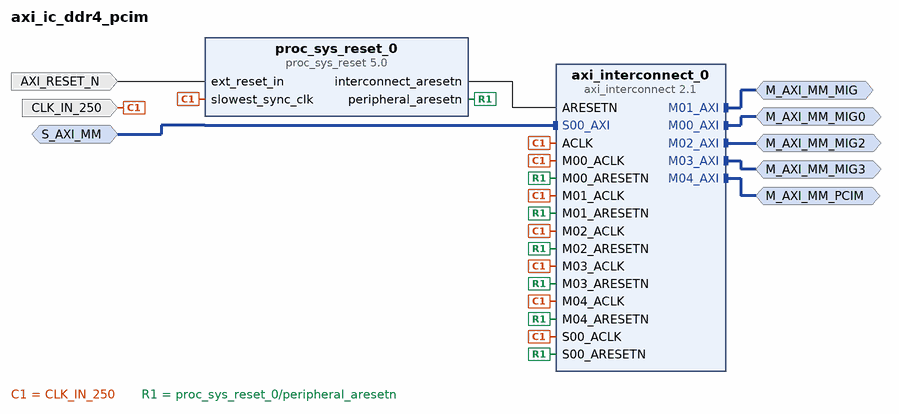
[diagram p0: block diagram of the top level]
# Vivado block design axi_ic_ddr4_pcim, xcu200-fsgd2104-2-e, Vivado 2019.2
create_bd_design axi_ic_ddr4_pcim

create_bd_intf_port -mode Slave -vlnv xilinx.com:interface:aximm_rtl:1.0 S_AXI_MM
set_property -dict [list \
  CONFIG.DATA_WIDTH 512 \
  CONFIG.PROTOCOL AXI4 \
  CONFIG.FREQ_HZ 250000000 \
  CONFIG.ID_WIDTH 6 \
  CONFIG.ADDR_WIDTH 64 \
  CONFIG.AWUSER_WIDTH 0 \
  CONFIG.ARUSER_WIDTH 0 \
  CONFIG.WUSER_WIDTH 0 \
  CONFIG.RUSER_WIDTH 0 \
  CONFIG.BUSER_WIDTH 0 \
  CONFIG.READ_WRITE_MODE READ_WRITE \
  CONFIG.HAS_BURST 1 \
  CONFIG.HAS_LOCK 1 \
  CONFIG.HAS_PROT 1 \
  CONFIG.HAS_CACHE 1 \
  CONFIG.HAS_QOS 1 \
  CONFIG.HAS_REGION 1 \
  CONFIG.HAS_WSTRB 1 \
  CONFIG.HAS_BRESP 1 \
  CONFIG.HAS_RRESP 1 \
  CONFIG.SUPPORTS_NARROW_BURST 0 \
  CONFIG.NUM_READ_OUTSTANDING 8 \
  CONFIG.NUM_WRITE_OUTSTANDING 8 \
  CONFIG.MAX_BURST_LENGTH 64 \
  CONFIG.CLK_DOMAIN PCIe_Bridge_ICAP_complex_xdma_0_0_axi_aclk \
  CONFIG.NUM_READ_THREADS 1 \
  CONFIG.NUM_WRITE_THREADS 1 \
  CONFIG.RUSER_BITS_PER_BYTE 0 \
  CONFIG.WUSER_BITS_PER_BYTE 0 \
] [get_bd_intf_ports S_AXI_MM]
create_bd_intf_port -mode Master -vlnv xilinx.com:interface:aximm_rtl:1.0 M_AXI_MM_MIG0
set_property -dict [list \
  CONFIG.DATA_WIDTH 512 \
  CONFIG.PROTOCOL AXI4 \
  CONFIG.FREQ_HZ 250000000 \
  CONFIG.ADDR_WIDTH 64 \
  CONFIG.NUM_READ_OUTSTANDING 8 \
  CONFIG.NUM_WRITE_OUTSTANDING 8 \
  CONFIG.CLK_DOMAIN PCIe_Bridge_ICAP_complex_xdma_0_0_axi_aclk \
] [get_bd_intf_ports M_AXI_MM_MIG0]
create_bd_intf_port -mode Master -vlnv xilinx.com:interface:aximm_rtl:1.0 M_AXI_MM_MIG
set_property -dict [list \
  CONFIG.DATA_WIDTH 512 \
  CONFIG.PROTOCOL AXI4 \
  CONFIG.FREQ_HZ 250000000 \
  CONFIG.ADDR_WIDTH 64 \
  CONFIG.NUM_READ_OUTSTANDING 8 \
  CONFIG.NUM_WRITE_OUTSTANDING 8 \
  CONFIG.CLK_DOMAIN PCIe_Bridge_ICAP_complex_xdma_0_0_axi_aclk \
] [get_bd_intf_ports M_AXI_MM_MIG]
create_bd_intf_port -mode Master -vlnv xilinx.com:interface:aximm_rtl:1.0 M_AXI_MM_MIG2
set_property -dict [list \
  CONFIG.DATA_WIDTH 512 \
  CONFIG.PROTOCOL AXI4 \
  CONFIG.FREQ_HZ 250000000 \
  CONFIG.ADDR_WIDTH 64 \
  CONFIG.NUM_READ_OUTSTANDING 8 \
  CONFIG.NUM_WRITE_OUTSTANDING 8 \
  CONFIG.CLK_DOMAIN PCIe_Bridge_ICAP_complex_xdma_0_0_axi_aclk \
] [get_bd_intf_ports M_AXI_MM_MIG2]
create_bd_intf_port -mode Master -vlnv xilinx.com:interface:aximm_rtl:1.0 M_AXI_MM_MIG3
set_property -dict [list \
  CONFIG.DATA_WIDTH 512 \
  CONFIG.PROTOCOL AXI4 \
  CONFIG.FREQ_HZ 250000000 \
  CONFIG.ADDR_WIDTH 64 \
  CONFIG.NUM_READ_OUTSTANDING 8 \
  CONFIG.NUM_WRITE_OUTSTANDING 8 \
  CONFIG.CLK_DOMAIN PCIe_Bridge_ICAP_complex_xdma_0_0_axi_aclk \
] [get_bd_intf_ports M_AXI_MM_MIG3]
create_bd_intf_port -mode Master -vlnv xilinx.com:interface:aximm_rtl:1.0 M_AXI_MM_PCIM
set_property -dict [list \
  CONFIG.DATA_WIDTH 512 \
  CONFIG.PROTOCOL AXI4 \
  CONFIG.FREQ_HZ 250000000 \
  CONFIG.ADDR_WIDTH 64 \
  CONFIG.NUM_READ_OUTSTANDING 8 \
  CONFIG.NUM_WRITE_OUTSTANDING 8 \
  CONFIG.CLK_DOMAIN PCIe_Bridge_ICAP_complex_xdma_0_0_axi_aclk \
] [get_bd_intf_ports M_AXI_MM_PCIM]
create_bd_port -dir I -type rst AXI_RESET_N
create_bd_port -dir I -type clk CLK_IN_250
set_property -dict [list \
  CONFIG.ASSOCIATED_BUSIF S_AXI_MM:M_AXI_MM_MIG3:M_AXI_MM_MIG2:M_AXI_MM_MIG:M_AXI_MM_MIG0:M_AXI_MM_PCIM \
  CONFIG.ASSOCIATED_RESET AXI_RESET_N \
  CONFIG.CLK_DOMAIN PCIe_Bridge_ICAP_complex_xdma_0_0_axi_aclk \
  CONFIG.FREQ_HZ 250000000 \
] [get_bd_ports CLK_IN_250]

create_bd_cell -type ip -vlnv xilinx.com:ip:proc_sys_reset:5.0 proc_sys_reset_0
create_bd_cell -type ip -vlnv xilinx.com:ip:axi_interconnect:2.1 axi_interconnect_0
set_property -dict [list \
  CONFIG.M00_HAS_REGSLICE 4 \
  CONFIG.M01_HAS_REGSLICE 4 \
  CONFIG.M02_HAS_REGSLICE 4 \
  CONFIG.M03_HAS_REGSLICE 4 \
  CONFIG.M04_HAS_REGSLICE 4 \
  CONFIG.NUM_MI 5 \
  CONFIG.S00_HAS_REGSLICE 4 \
] [get_bd_cells axi_interconnect_0]

# ---- connections ----

connect_bd_intf_net [get_bd_intf_ports M_AXI_MM_MIG3] [get_bd_intf_pins axi_interconnect_0/M03_AXI]
connect_bd_intf_net [get_bd_intf_ports M_AXI_MM_PCIM] [get_bd_intf_pins axi_interconnect_0/M04_AXI]
connect_bd_intf_net [get_bd_intf_ports M_AXI_MM_MIG0] [get_bd_intf_pins axi_interconnect_0/M00_AXI]
connect_bd_intf_net [get_bd_intf_ports M_AXI_MM_MIG2] [get_bd_intf_pins axi_interconnect_0/M02_AXI]
connect_bd_intf_net [get_bd_intf_ports M_AXI_MM_MIG] [get_bd_intf_pins axi_interconnect_0/M01_AXI]
connect_bd_intf_net -intf_net AXI_MASTER_0_1 [get_bd_intf_ports S_AXI_MM] [get_bd_intf_pins axi_interconnect_0/S00_AXI]
connect_bd_net [get_bd_ports AXI_RESET_N] [get_bd_pins proc_sys_reset_0/ext_reset_in]
connect_bd_net -net CLK_IN_250_1 [get_bd_ports CLK_IN_250] \
  [get_bd_pins proc_sys_reset_0/slowest_sync_clk] [get_bd_pins axi_interconnect_0/ACLK] \
  [get_bd_pins axi_interconnect_0/S00_ACLK] [get_bd_pins axi_interconnect_0/M00_ACLK] \
  [get_bd_pins axi_interconnect_0/M01_ACLK] [get_bd_pins axi_interconnect_0/M02_ACLK] \
  [get_bd_pins axi_interconnect_0/M03_ACLK] [get_bd_pins axi_interconnect_0/M04_ACLK]
connect_bd_net [get_bd_pins proc_sys_reset_0/interconnect_aresetn] [get_bd_pins axi_interconnect_0/ARESETN]
connect_bd_net [get_bd_pins proc_sys_reset_0/peripheral_aresetn] \
  [get_bd_pins axi_interconnect_0/S00_ARESETN] [get_bd_pins axi_interconnect_0/M00_ARESETN] \
  [get_bd_pins axi_interconnect_0/M01_ARESETN] [get_bd_pins axi_interconnect_0/M02_ARESETN] \
  [get_bd_pins axi_interconnect_0/M03_ARESETN] [get_bd_pins axi_interconnect_0/M04_ARESETN]

# ---- address map ----
assign_bd_address -offset 0x0000000000000000 -range 8E -target_address_space [get_bd_addr_spaces S_AXI_MM] [get_bd_addr_segs M_AXI_MM_PCIM/Reg]
assign_bd_address -offset 0x8000000000000000 -range 16G -target_address_space [get_bd_addr_spaces S_AXI_MM] [get_bd_addr_segs M_AXI_MM_MIG/Reg]
assign_bd_address -offset 0x8000000400000000 -range 16G -target_address_space [get_bd_addr_spaces S_AXI_MM] [get_bd_addr_segs M_AXI_MM_MIG0/Reg]
assign_bd_address -offset 0x8000000800000000 -range 16G -target_address_space [get_bd_addr_spaces S_AXI_MM] [get_bd_addr_segs M_AXI_MM_MIG2/Reg]
assign_bd_address -offset 0x8000000C00000000 -range 16G -target_address_space [get_bd_addr_spaces S_AXI_MM] [get_bd_addr_segs M_AXI_MM_MIG3/Reg]

validate_bd_design
save_bd_design
